# EAGLE schematic nixie_test_v3_arduino (EAGLE 6.1)
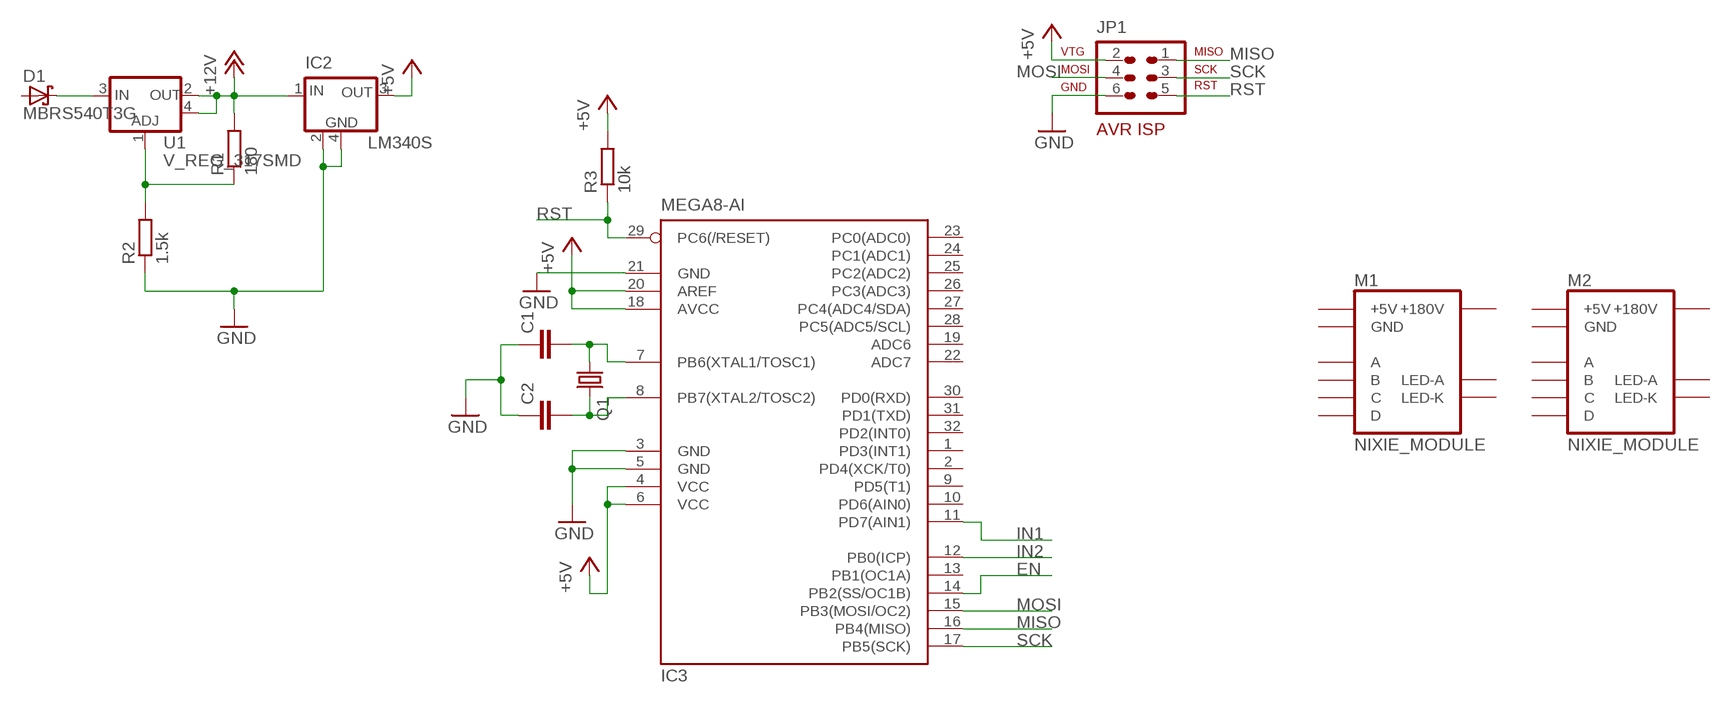
[diagram p0: schematic, sheet 1]

## Parts
C1  C-EUC0805K  [C0805K]
C2  C-EUC0805K  [C0805K]
D1  MBRS540T3G  [SMC]
IC2  LM340S  [SOT223]
IC3  MEGA8-AI  [TQFP32-08]
JP1  AVR-ISP-6  [AVR-ISP-6]
M1  NIXIE_MODULE  [NIXIE_MODULE]
M2  NIXIE_MODULE  [NIXIE_MODULE]
Q1  CRYSTALHC49UP  [HC49UP]
R1  180  R-EU_R0805  [R0805]
R2  1.5k  R-EU_R0805  [R0805]
R3  10k  R-EU_R0805  [R0805]
U1  V_REG_317SMD  [SOT223]

## Nets
+5V: IC2.3(OUT) IC3.4(VCC) IC3.6(VCC) IC3.18(AVCC) IC3.20(AREF) JP1.2(VTG) R3.2
+12V: IC2.1(IN) R1.2 U1.2(OUT) U1.4(OUT)
EN: IC3.14(PB2(SS/OC1B))
GND: C1.1 C2.1 IC2.2(GND) IC2.4(GND) IC3.3(GND) IC3.5(GND) IC3.21(GND) JP1.6(GND) R2.1
IN1: IC3.11(PD7(AIN1))
IN2: IC3.12(PB0(ICP))
MISO: IC3.16(PB4(MISO)) JP1.1(MISO)
MOSI: IC3.15(PB3(MOSI/OC2)) JP1.4(MOSI)
N$2: C2.2 IC3.8(PB7(XTAL2/TOSC2)) Q1.2
N$3: D1.C U1.3(IN)
N$4: C1.2 IC3.7(PB6(XTAL1/TOSC1)) Q1.1
N$6: R1.1 R2.2 U1.1(ADJ)
RST: IC3.29(PC6(/RESET)) JP1.5(RST) R3.1
SCK: IC3.17(PB5(SCK)) JP1.3(SCK)
Unconnected: D1.A IC3.1(PD3(INT1)) IC3.2(PD4(XCK/T0)) IC3.9(PD5(T1)) IC3.10(PD6(AIN0)) IC3.13(PB1(OC1A)) IC3.19(ADC6) IC3.22(ADC7) IC3.23(PC0(ADC0)) IC3.24(PC1(ADC1)) IC3.25(PC2(ADC2)) IC3.26(PC3(ADC3)) IC3.27(PC4(ADC4/SDA)) IC3.28(PC5(ADC5/SCL)) IC3.30(PD0(RXD)) IC3.31(PD1(TXD)) IC3.32(PD2(INT0)) M1.A M1.B M1.C M1.D M1.LA(LED-A) M1.LK(LED-K) M2.A M2.B M2.C M2.D M2.LA(LED-A) M2.LK(LED-K)

## Power pins joined to a net without a drawn wire
+5V: M1.+5V M2.+5V
+180V: M1.H@0(+180V) M1.H@1(+180V) M2.H@0(+180V) M2.H@1(+180V)
GND: M1.GND M2.GND

## Library data of the parts
C1 C2 = nixie_tube:C-EU: CAPACITOR, European symbol
D1 = nixie_tube:MBRS540T3G: SCHOTTKY BARRIER RECTIFIER 5.0 AMPERES 40 VOLT
IC2 = ciencia prima:LM340S: 3-Terminal Positive Regulators Source: http://cache.national.com/ds/LM/LM340.pdf
IC3 = ciencia prima:MEGA8: MICROCONTROLLER 8 Kbytes FLASH, 1 kbytes SRAM, 512 bytes EEPROM, USART, 6-channel 10 bit ADC, 2-channel 8 bit ADC Pin compatible with Atmega48, ATMega88, ATMega168 Source: avr.lbr; MPN: ATMEGA8-16AU; OC_FARNELL: 9171371; OC_NEWARK: 73M8863
JP1 = nixie_tube:AVR-ISP-6: AVR ISP-6 Serial Programming Header
M1 M2 = nixie_tube:NIXIE_MODULE
Q1 = ciencia prima:CRYSTAL: CRYSTAL
R1-R3 = nixie_tube:R-EU_: RESISTOR, European symbol
U1 = ciencia prima:V_REG_317: Voltage Regulator Standard LM317 adjustable voltage regulator. AOI (Adjust Output Input). Google 'LM317 Calculator' for easy to use app to get the two resistor values needed. 240/720 for 5V output. 240/390 for 3.3V output. Spark Fun Electronics SKU : COM-00527